# EAGLE design sensorboard_eurobotics2010_r4 (EAGLE 4.16)

## Sheet 1 of 2
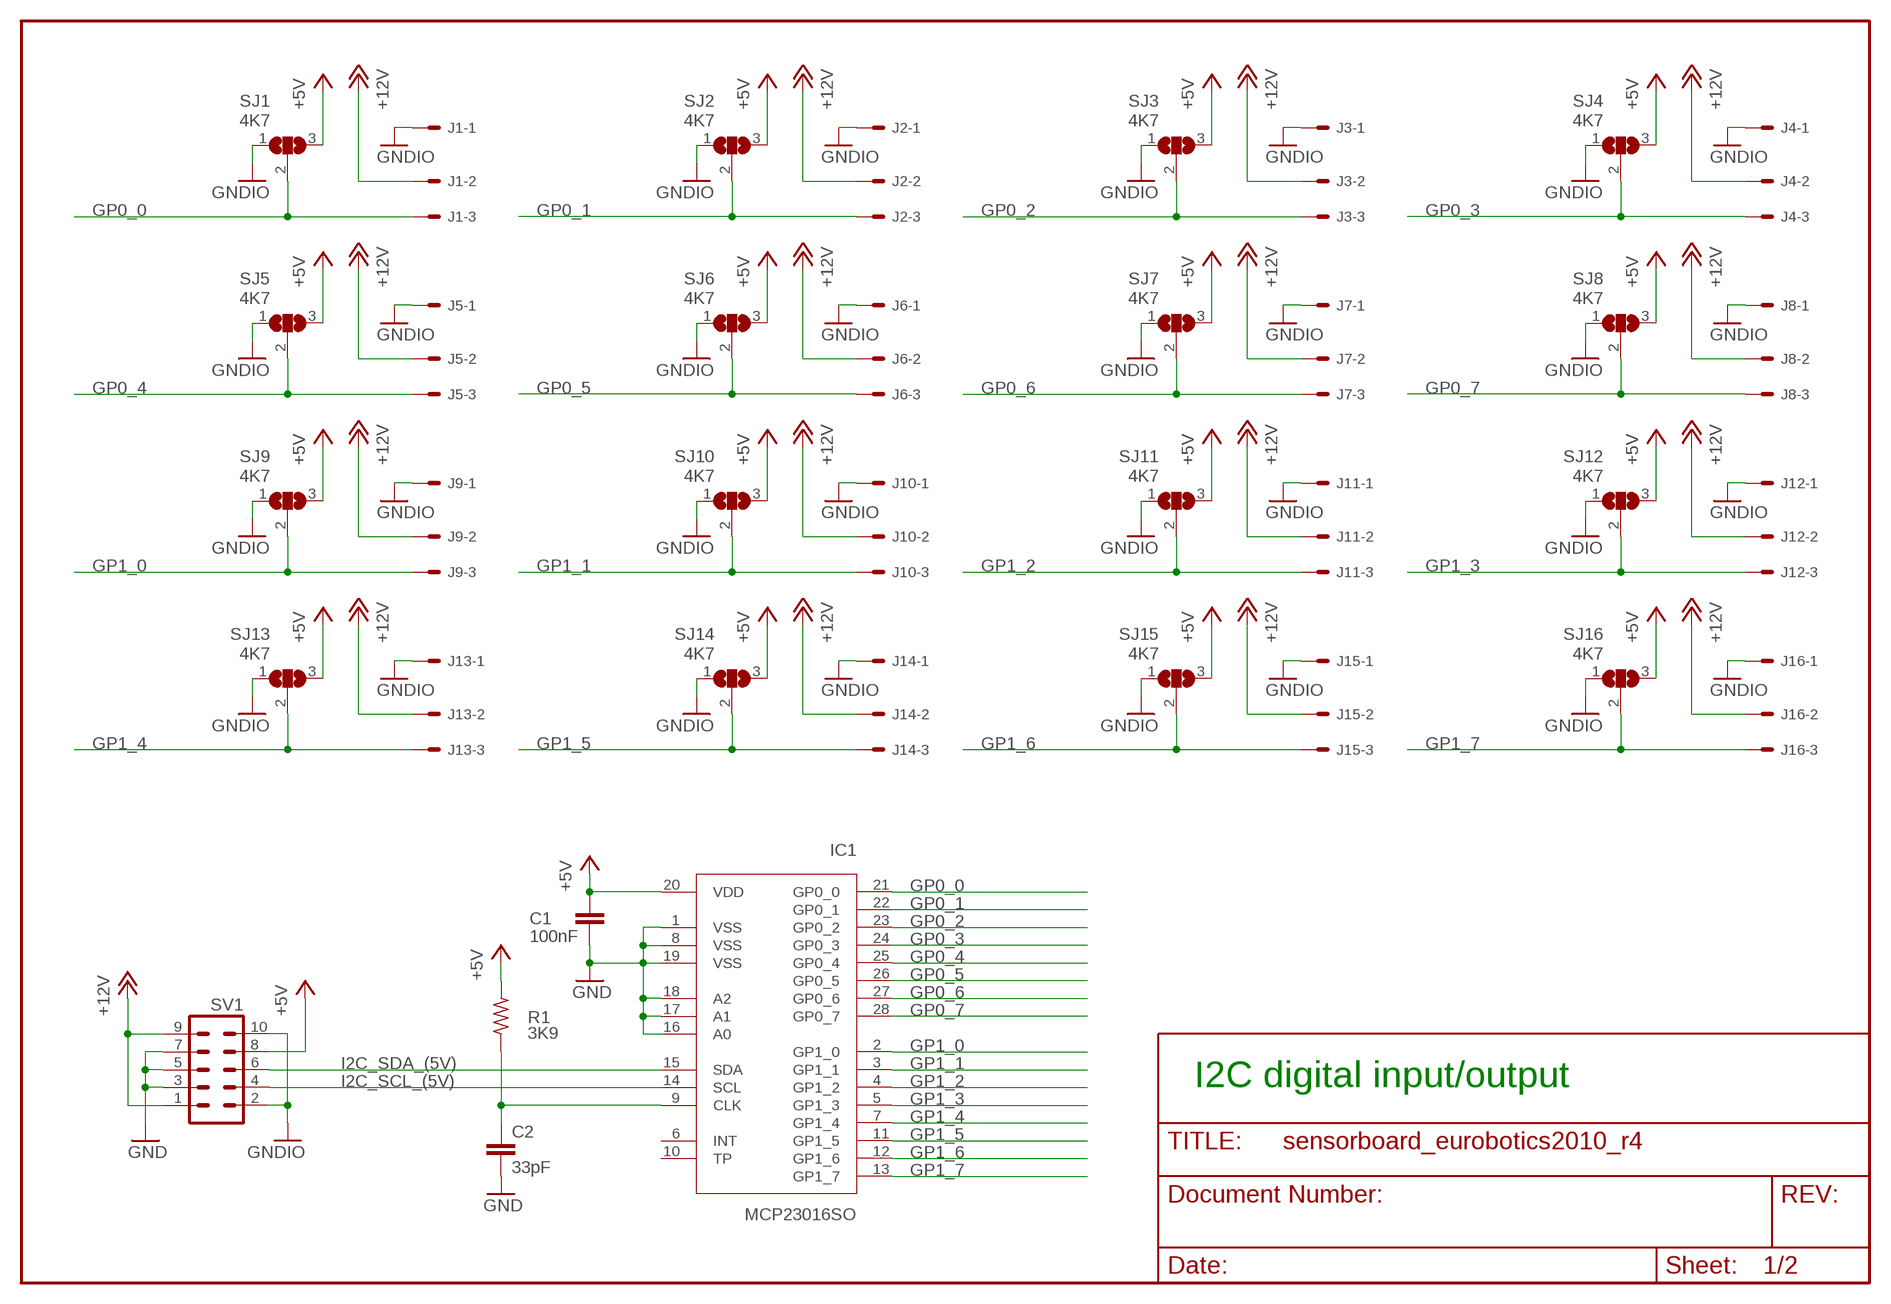
[diagram p0: schematic, sheet 1]

### Parts
C1  100nF  C-EUC0805  [C0805]
C2  33pF  C-EUC0805  [C0805]
IC1  MCP23016SO  MCP32016SO  [SO-28W]
J1  22-27-2031-03  [6410-03]
J2  22-27-2031-03  [6410-03]
J3  22-27-2031-03  [6410-03]
J4  22-27-2031-03  [6410-03]
J5  22-27-2031-03  [6410-03]
J6  22-27-2031-03  [6410-03]
J7  22-27-2031-03  [6410-03]
J8  22-27-2031-03  [6410-03]
J9  22-27-2031-03  [6410-03]
J10  22-27-2031-03  [6410-03]
J11  22-27-2031-03  [6410-03]
J12  22-27-2031-03  [6410-03]
J13  22-27-2031-03  [6410-03]
J14  22-27-2031-03  [6410-03]
J15  22-27-2031-03  [6410-03]
J16  22-27-2031-03  [6410-03]
R1  3K9  R-US_R0805  [R0805]
SJ1  4K7  SJ2W  [SJ_2]
SJ2  4K7  SJ2W  [SJ_2]
SJ3  4K7  SJ2W  [SJ_2]
SJ4  4K7  SJ2W  [SJ_2]
SJ5  4K7  SJ2W  [SJ_2]
SJ6  4K7  SJ2W  [SJ_2]
SJ7  4K7  SJ2W  [SJ_2]
SJ8  4K7  SJ2W  [SJ_2]
SJ9  4K7  SJ2W  [SJ_2]
SJ10  4K7  SJ2W  [SJ_2]
SJ11  4K7  SJ2W  [SJ_2]
SJ12  4K7  SJ2W  [SJ_2]
SJ13  4K7  SJ2W  [SJ_2]
SJ14  4K7  SJ2W  [SJ_2]
SJ15  4K7  SJ2W  [SJ_2]
SJ16  4K7  SJ2W  [SJ_2]
SV1  ML10  [ML10]

### Nets
+5V: C1.1 IC1.20(VDD) R1.2 SJ1.3 SJ2.3 SJ3.3 SJ4.3 SJ5.3 SJ6.3 SJ7.3 SJ8.3 SJ9.3 SJ10.3 SJ11.3 SJ12.3 SJ13.3 SJ14.3 SJ15.3 SJ16.3 SV1.8 ; also sheet 2
+12V: J1.2 J2.2 J3.2 J4.2 J5.2 J6.2 J7.2 J8.2 J9.2 J10.2 J11.2 J12.2 J13.2 J14.2 J15.2 J16.2 SV1.1 SV1.9 ; also sheet 2
GND: C1.2 C2.2 IC1.1(VSS) IC1.8(VSS) IC1.16(A0) IC1.17(A1) IC1.18(A2) IC1.19(VSS) SV1.3 SV1.5 SV1.7 ; also sheet 2
GNDIO: J1.1 J2.1 J3.1 J4.1 J5.1 J6.1 J7.1 J8.1 J9.1 J10.1 J11.1 J12.1 J13.1 J14.1 J15.1 J16.1 SJ1.1 SJ2.1 SJ3.1 SJ4.1 SJ5.1 SJ6.1 SJ7.1 SJ8.1 SJ9.1 SJ10.1 SJ11.1 SJ12.1 SJ13.1 SJ14.1 SJ15.1 SJ16.1 SV1.2 SV1.10 ; also sheet 2
GP0_0: IC1.21(GP0_0) J1.3 SJ1.2
GP0_1: IC1.22(GP0_1) J2.3 SJ2.2
GP0_2: IC1.23(GP0_2) J3.3 SJ3.2
GP0_3: IC1.24(GP0_3) J4.3 SJ4.2
GP0_4: IC1.25(GP0_4) J5.3 SJ5.2
GP0_5: IC1.26(GP0_5) J6.3 SJ6.2
GP0_6: IC1.27(GP0_6) J7.3 SJ7.2
GP0_7: IC1.28(GP0_7) J8.3 SJ8.2
GP1_0: IC1.2(GP1_0) J9.3 SJ9.2
GP1_1: IC1.3(GP1_1) J10.3 SJ10.2
GP1_2: IC1.4(GP1_2) J11.3 SJ11.2
GP1_3: IC1.5(GP1_3) J12.3 SJ12.2
GP1_4: IC1.7(GP1_4) J13.3 SJ13.2
GP1_5: IC1.11(GP1_5) J14.3 SJ14.2
GP1_6: IC1.12(GP1_6) J15.3 SJ15.2
GP1_7: IC1.13(GP1_7) J16.3 SJ16.2
I2C_SCL_(5V): IC1.14(SCL) SV1.4 ; also sheet 2
I2C_SDA_(5V): IC1.15(SDA) SV1.6 ; also sheet 2
N$63: C2.1 IC1.9(CLK) R1.1
Unconnected: IC1.6(INT) IC1.10(TP)

### Notes on the sheet
- I2C digital input/output

## Sheet 2 of 2
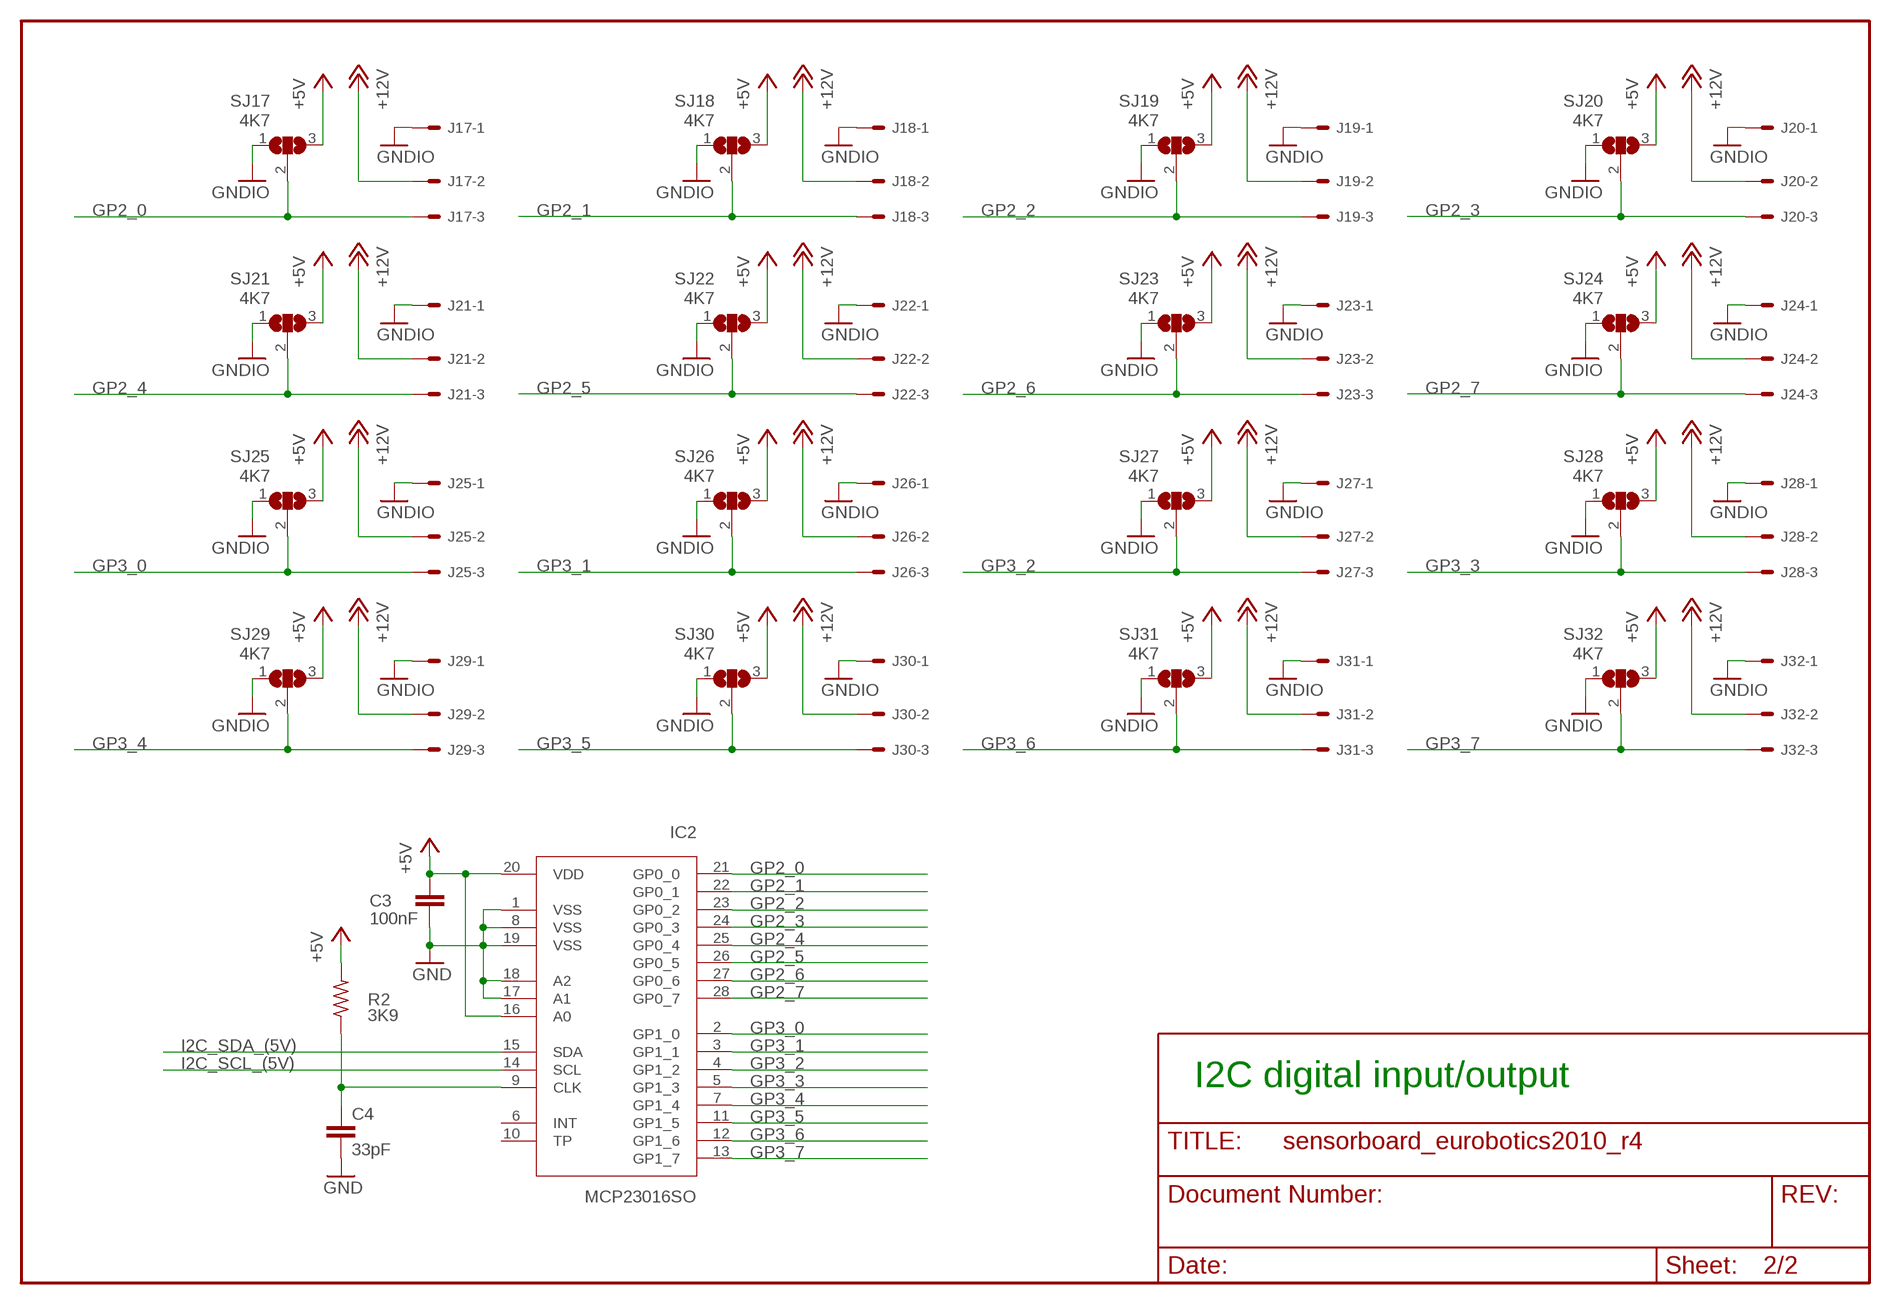
[diagram p1: schematic, sheet 2]

### Parts
C3  100nF  C-EUC0805  [C0805]
C4  33pF  C-EUC0805  [C0805]
IC2  MCP23016SO  MCP32016SO  [SO-28W]
J17  22-27-2031-03  [6410-03]
J18  22-27-2031-03  [6410-03]
J19  22-27-2031-03  [6410-03]
J20  22-27-2031-03  [6410-03]
J21  22-27-2031-03  [6410-03]
J22  22-27-2031-03  [6410-03]
J23  22-27-2031-03  [6410-03]
J24  22-27-2031-03  [6410-03]
J25  22-27-2031-03  [6410-03]
J26  22-27-2031-03  [6410-03]
J27  22-27-2031-03  [6410-03]
J28  22-27-2031-03  [6410-03]
J29  22-27-2031-03  [6410-03]
J30  22-27-2031-03  [6410-03]
J31  22-27-2031-03  [6410-03]
J32  22-27-2031-03  [6410-03]
R2  3K9  R-US_R0805  [R0805]
SJ17  4K7  SJ2W  [SJ_2]
SJ18  4K7  SJ2W  [SJ_2]
SJ19  4K7  SJ2W  [SJ_2]
SJ20  4K7  SJ2W  [SJ_2]
SJ21  4K7  SJ2W  [SJ_2]
SJ22  4K7  SJ2W  [SJ_2]
SJ23  4K7  SJ2W  [SJ_2]
SJ24  4K7  SJ2W  [SJ_2]
SJ25  4K7  SJ2W  [SJ_2]
SJ26  4K7  SJ2W  [SJ_2]
SJ27  4K7  SJ2W  [SJ_2]
SJ28  4K7  SJ2W  [SJ_2]
SJ29  4K7  SJ2W  [SJ_2]
SJ30  4K7  SJ2W  [SJ_2]
SJ31  4K7  SJ2W  [SJ_2]
SJ32  4K7  SJ2W  [SJ_2]

### Nets
+5V: C3.1 IC2.16(A0) IC2.20(VDD) R2.2 SJ17.3 SJ18.3 SJ19.3 SJ20.3 SJ21.3 SJ22.3 SJ23.3 SJ24.3 SJ25.3 SJ26.3 SJ27.3 SJ28.3 SJ29.3 SJ30.3 SJ31.3 SJ32.3 ; also sheet 1
+12V: J17.2 J18.2 J19.2 J20.2 J21.2 J22.2 J23.2 J24.2 J25.2 J26.2 J27.2 J28.2 J29.2 J30.2 J31.2 J32.2 ; also sheet 1
GND: C3.2 C4.2 IC2.1(VSS) IC2.8(VSS) IC2.17(A1) IC2.18(A2) IC2.19(VSS) ; also sheet 1
GNDIO: J17.1 J18.1 J19.1 J20.1 J21.1 J22.1 J23.1 J24.1 J25.1 J26.1 J27.1 J28.1 J29.1 J30.1 J31.1 J32.1 SJ17.1 SJ18.1 SJ19.1 SJ20.1 SJ21.1 SJ22.1 SJ23.1 SJ24.1 SJ25.1 SJ26.1 SJ27.1 SJ28.1 SJ29.1 SJ30.1 SJ31.1 SJ32.1 ; also sheet 1
GP2_0: IC2.21(GP0_0) J17.3 SJ17.2
GP2_1: IC2.22(GP0_1) J18.3 SJ18.2
GP2_2: IC2.23(GP0_2) J19.3 SJ19.2
GP2_3: IC2.24(GP0_3) J20.3 SJ20.2
GP2_4: IC2.25(GP0_4) J21.3 SJ21.2
GP2_5: IC2.26(GP0_5) J22.3 SJ22.2
GP2_6: IC2.27(GP0_6) J23.3 SJ23.2
GP2_7: IC2.28(GP0_7) J24.3 SJ24.2
GP3_0: IC2.2(GP1_0) J25.3 SJ25.2
GP3_1: IC2.3(GP1_1) J26.3 SJ26.2
GP3_2: IC2.4(GP1_2) J27.3 SJ27.2
GP3_3: IC2.5(GP1_3) J28.3 SJ28.2
GP3_4: IC2.7(GP1_4) J29.3 SJ29.2
GP3_5: IC2.11(GP1_5) J30.3 SJ30.2
GP3_6: IC2.12(GP1_6) J31.3 SJ31.2
GP3_7: IC2.13(GP1_7) J32.3 SJ32.2
I2C_SCL_(5V): IC2.14(SCL) ; also sheet 1
I2C_SDA_(5V): IC2.15(SDA) ; also sheet 1
N$2: C4.1 IC2.9(CLK) R2.1
Unconnected: IC2.6(INT) IC2.10(TP)

### Notes on the sheet
- I2C digital input/output

## Library data of the parts
C1-C4 = rcl:C-EU: CAPACITOR, European symbol
IC1 IC2 = eagle_jbs_lib:MCP32016: 16-Bit I2C I/O Expander
J1-J32 = con-molex:22-?-03: CONNECTOR wire to board 2.54 mm (.1 inch) pitch header
R1 R2 = rcl:R-US_: RESISTOR, American symbol
SJ1-SJ32 = jumper:SJ2W: SMD solder JUMPER
SV1 = con-harting-ml:ML10: HARTING

## Board
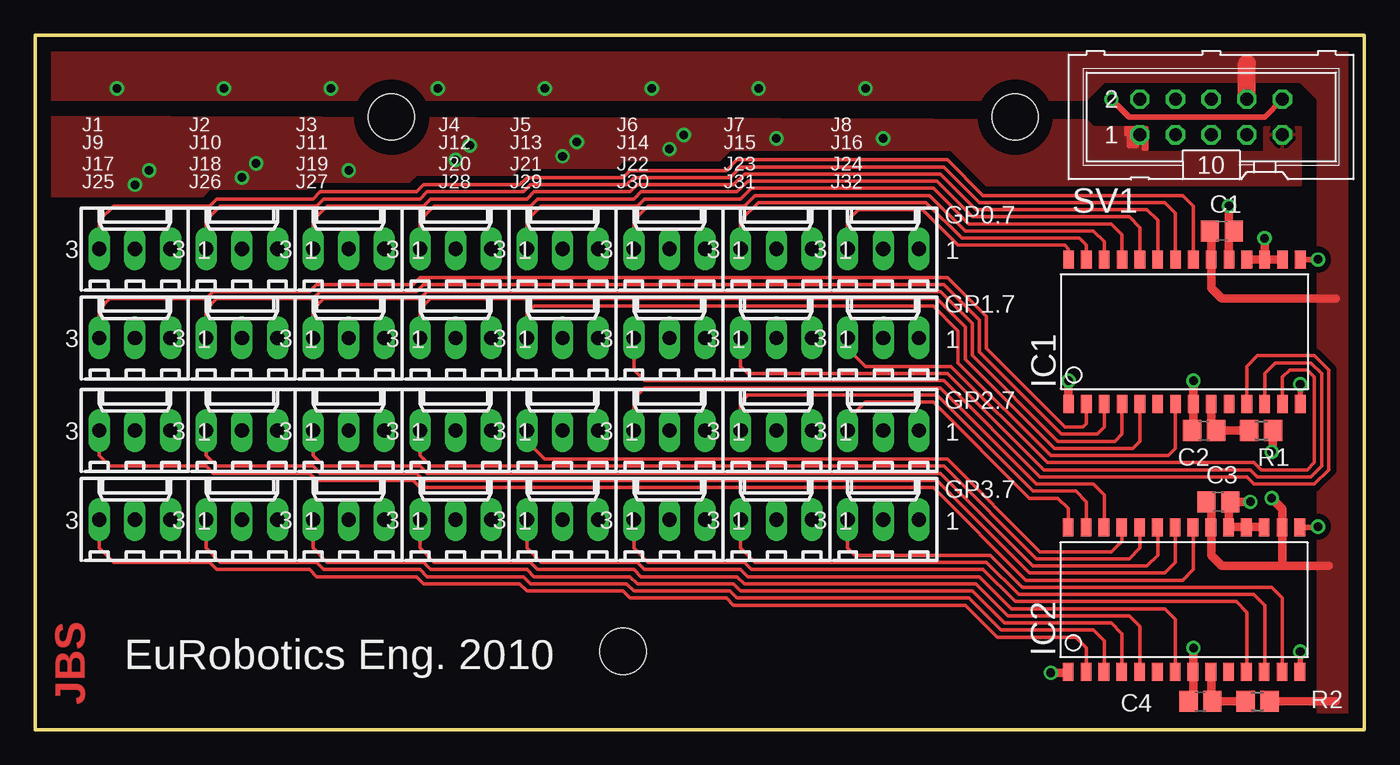
[diagram p2: board, top side]
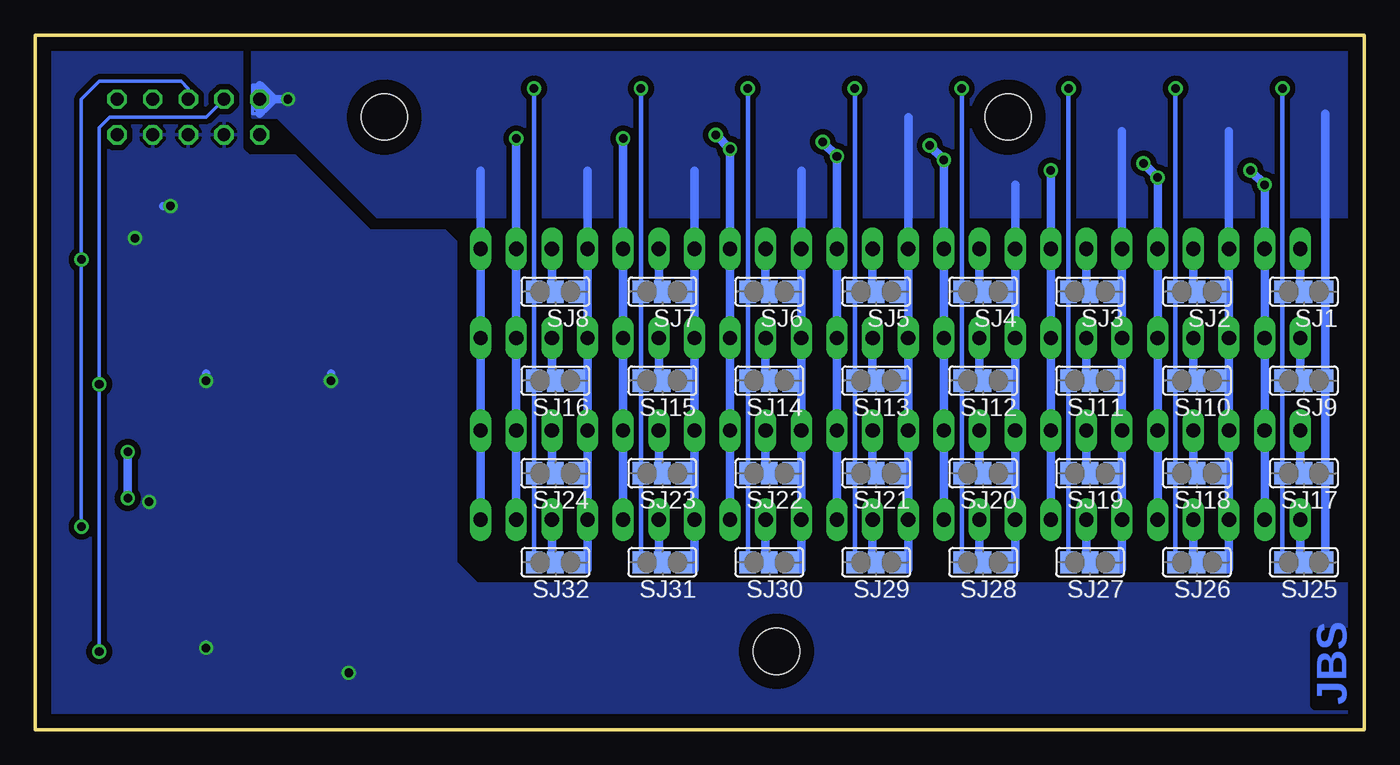
[diagram p3: board, bottom side, seen from below]

Size 94.74 x 49.53 mm. Coordinates in mm from the lower left corner, seen from the top.
Outline: 0,0 0,49.53 94.74,49.53 94.74,0 0,0
Copper layers (1*16): Top 0.035mm / dielectric 1.5mm / Bottom 0.035mm
Design rules "olimex": minimum track width 10mil, minimum drill 24mil, track to track 8mil, track to pad 8mil, pad to pad 8mil, via to via 8mil, smd to smd 8mil, copper to edge 40mil, drill to drill 8mil, minimum pad ring 8mil, minimum via ring 8mil, stop-mask expansion 4mil, vias tented up to drill 0mil, thermal gap 10mil
Holes 3.3 mm at 69.85,43.69 25.4,43.69 41.91,5.59

### Footprints (pad centres in the part's own frame; a part is rotated, then mirrored left to right if it is on the bottom)
C0805 = smd 1.3 x 1.5: 1 -0.85,0; 2 0.85,0
SO-28W = smd 0.762 x 1.27: 1 -7.62,-5.207; 2 -6.35,-5.207; 3 -5.08,-5.207; 4 -3.81,-5.207; 5 -2.54,-5.207; 6 -1.27,-5.207; 7 0,-5.207; 8 1.27,-5.207; 9 2.54,-5.207; 10 3.81,-5.207; 11 5.08,-5.207; 12 6.35,-5.207; 13 7.62,-5.207; 14 8.89,-5.207; 15 8.89,5.08; 16 7.62,5.08; 17 6.35,5.08; 18 5.08,5.08; 19 3.81,5.08; 20 2.54,5.08; 21 1.27,5.08; 22 0,5.08; 23 -1.27,5.08; 24 -2.54,5.08; 25 -3.81,5.08; 26 -5.08,5.08; 27 -6.35,5.08; 28 -7.62,5.08
6410-03 = drill 1.016 long: 1 2.54,0; 2 0,0; 3 -2.54,0
R0805 = smd 1.3 x 1.5: 1 -0.85,0; 2 0.85,0
SJ_2 = smd 1.168 x 1.6: 1 -1.524,0; 2 0,0; 3 1.524,0
ML10 = drill 0.914 octagon: 1 -5.08,-1.27; 2 -5.08,1.27; 3 -2.54,-1.27; 4 -2.54,1.27; 5 0,-1.27; 6 0,1.27; 7 2.54,-1.27; 8 2.54,1.27; 9 5.08,-1.27; 10 5.08,1.27

### Placement (x,y rotation side)
C1  84.58,35.56 0 top
C2  83.31,21.34 180 top
C3  84.33,16.26 0 top
C4  83.06,2.03 180 top
IC1  81.28,28.45 0 top
IC2  81.25,9.34 0 top
J1  7.11,34.29 0 top
J2  14.73,34.29 0 top
J3  22.35,34.29 0 top
J4  29.97,34.29 0 top
J5  37.59,34.29 0 top
J6  45.21,34.29 0 top
J7  52.83,34.29 0 top
J8  60.45,34.29 0 top
J9  7.11,27.94 0 top
J10  14.73,27.94 0 top
J11  22.35,27.94 0 top
J12  29.97,27.94 0 top
J13  37.59,27.94 0 top
J14  45.21,27.94 0 top
J15  52.83,27.94 0 top
J16  60.45,27.94 0 top
J17  7.11,21.34 0 top
J18  14.73,21.34 0 top
J19  22.35,21.34 0 top
J20  29.97,21.34 0 top
J21  37.59,21.34 0 top
J22  45.21,21.34 0 top
J23  52.83,21.34 0 top
J24  60.45,21.34 0 top
J25  7.11,14.99 0 top
J26  14.73,14.99 0 top
J27  22.35,14.99 0 top
J28  29.97,14.99 0 top
J29  37.59,14.99 0 top
J30  45.21,14.99 0 top
J31  52.83,14.99 0 top
J32  60.45,14.99 0 top
R1  87.38,21.34 0 top
R2  87.12,2.03 0 top
SJ1  4.32,31.24 180 bottom
SJ2  11.94,31.24 180 bottom
SJ3  19.56,31.24 180 bottom
SJ4  27.18,31.24 180 bottom
SJ5  34.8,31.24 180 bottom
SJ6  42.42,31.24 180 bottom
SJ7  50.04,31.24 180 bottom
SJ8  57.66,31.24 180 bottom
SJ9  4.32,24.89 180 bottom
SJ10  11.94,24.89 180 bottom
SJ11  19.56,24.89 180 bottom
SJ12  27.18,24.89 180 bottom
SJ13  34.8,24.89 180 bottom
SJ14  42.42,24.89 180 bottom
SJ15  50.04,24.89 180 bottom
SJ16  57.66,24.89 180 bottom
SJ17  4.32,18.29 180 bottom
SJ18  11.94,18.29 180 bottom
SJ19  19.56,18.29 180 bottom
SJ20  27.18,18.29 180 bottom
SJ21  34.8,18.29 180 bottom
SJ22  42.42,18.29 180 bottom
SJ23  50.04,18.29 180 bottom
SJ24  57.66,18.29 180 bottom
SJ25  4.32,11.94 180 bottom
SJ26  11.94,11.94 180 bottom
SJ27  19.56,11.94 180 bottom
SJ28  27.18,11.94 180 bottom
SJ29  34.8,11.94 180 bottom
SJ30  42.42,11.94 180 bottom
SJ31  50.04,11.94 180 bottom
SJ32  57.66,11.94 180 bottom
SV1  83.82,43.69 0 top

### Tracks (layer width: path | path; a pad name or v marks a point on that pad's centre or on a via)
+5V  (via drill 0.61)
  Top 0.61: C1.1 83.82,35.56 IC1.20 83.82,31.5 84.58,30.73 92.71,30.73 | C3.1 83.82,16.26 83.82,14.48 | 88.9,11.68 88.9,14.39 IC2.16 88.87,14.45 88.9,14.48 88.9,15.75 v88.14,16.51 | 83.82,14.48 83.82,14.46 IC2.20 | 83.82,14.48 83.82,12.45 84.58,11.68 88.9,11.68 | 88.9,11.68 92.2,11.68 | 92.71,2.03 R2.2 | R1.2 88.23,19.9 v88.14,19.81
  Top 1.27: SV1.8 86.36,47.5
  Bottom 0.305: SJ25.3 SJ17.3 SJ9.3 SJ1.3 | SJ2.3 SJ10.3 SJ18.3 SJ26.3 v13.46,45.72 | SJ3.3 SJ11.3 SJ19.3 SJ27.3 SJ3.3 | SJ4.3 SJ12.3 SJ20.3 SJ28.3 SJ4.3 | SJ5.3 SJ13.3 SJ21.3 SJ29.3 v36.32,45.72 | SJ30.3 SJ22.3 SJ14.3 SJ6.3 v43.94,45.72 | SJ31.3 SJ23.3 SJ15.3 SJ7.3 | SJ32.3 SJ24.3 SJ16.3 SJ8.3 | SJ8.3 59.18,43.94 | SJ1.3 5.84,43.94 | SJ31.3 51.56,43.94 | SJ4.3 28.7,43.94 | SJ3.3 21.08,43.94 | v5.84,45.72 SJ1.3 | v21.08,45.72 SJ3.3 | v28.7,45.72 SJ4.3 | v51.56,45.72 SJ31.3 | v59.18,45.72 SJ8.3
  Bottom 0.61: v88.14,19.81 v88.14,16.51
  pour Top (isolate 0.406): 91.44,-0.76 95.25,-0.76 95,50.04 -1.27,50.04 -1.27,44.96 74.93,44.96 76.2,46.23 90.17,46.23 91.44,44.96
+12V  (via drill 0.61)
  Top 0.254: SV1.1 77.72,42.42 77.72,42.93 79.25,42.93 79.25,41.4 78.99,41.4 78.99,42.67
  Top 0.406: 78.99,42.67 77.98,42.67 77.98,41.66 78.49,41.66 78.49,42.16 78.23,42.16 78.23,41.91
  Bottom 0.61: 7.11,34.04 J9.2 J17.2 J25.2 | J26.2 J18.2 J10.2 J2.2 v14.73,39.37 v15.75,40.39 | J27.2 J19.2 J11.2 22.35,34.04 | J28.2 J20.2 J12.2 J4.2 v29.97,40.64 v30.99,41.66 | J21.2 37.59,21.59 | J21.2 J29.2 v37.59,40.89 v38.61,41.91 | J21.2 J13.2 J5.2 37.59,34.54 | J30.2 J22.2 J14.2 | J14.2 45.21,28.19 | J14.2 J6.2 v45.21,41.4 v46.23,42.42 | J31.2 J23.2 J15.2 J7.2 v52.83,42.16 | J32.2 J24.2 J16.2 J8.2 v60.45,42.16 | 7.11,34.04 J1.2 | 22.35,34.04 J3.2 | v8.13,39.88 v7.11,38.86 7.11,34.04 | v22.35,39.88 22.35,34.04
  pour Top (isolate 0.406): 90.17,42.93 90.17,38.86 67.82,38.86 65.28,41.4 49.53,41.4 48.77,40.64 41.91,40.64 41.4,40.13 34.54,40.13 34.04,39.62 27.18,39.62 26.67,39.12 19.81,39.12 19.3,38.61 12.45,38.61 11.94,38.1 -1.27,38.1 -1.27,43.69 74.93,43.43 75.44,42.93 79.25,42.93 79.25,41.15 87.63,41.15 87.63,42.93
GND  (via drill 0.61)
  Top 0.61: IC1.17 IC1.16 IC1.17 | IC1.17 IC1.18 IC1.17 | 85.09,35.56 IC1.19 | 85.09,35.56 C1.2 | v85.09,37.34 85.09,35.56 | IC1.17 v87.63,35.05 | IC2.19 85.09,14.46 85.09,14.48 | 85.09,14.48 85.09,16.26 C3.2 v86.61,16.26 | 87.63,14.48 87.63,14.46 IC2.17 | IC2.18 86.38,14.48 87.63,14.48 | v73.66,24.89 IC1.1 | C2.2 82.55,21.34 IC1.8 v82.55,24.89 | C4.2 82.55,2.03 82.55,4.11 IC2.8 82.55,4.17 v82.55,5.84 | IC2.1 73.55,4.06 v72.39,4.06 | 85.09,14.48 87.63,14.48
  Bottom 0.61: v85.09,37.34 85.6,37.34 | v86.61,16.26 86.61,16.51 | v73.66,24.89 73.66,25.4 | v82.55,24.89 82.55,25.4 | v82.55,5.84 82.55,6.1 | v72.39,4.06 72.14,4.06
  pour Bottom (isolate 0.406): 70.87,35.56 65.53,35.56 64.77,34.8 64.77,11.94 63.25,10.41 -1.27,10.41 -1.27,-0.76 95.25,-0.76 95.25,51.31 80.01,51.31 80.01,41.4 79.5,40.89 76.2,40.89
GNDIO  (via drill 0.61)
  Top 0.406: SV1.10 87.63,43.69 77.98,43.69 v76.71,44.96
  Bottom 0.254: 78.49,44.2 78.49,43.94 79.25,43.94 79.25,45.97 78.99,45.97 78.99,44.2
  Bottom 0.406: v76.71,44.96 76.71,45.21
  Bottom 0.61: J24.1 62.99,21.59 | J24.1 J32.1 | J16.1 62.99,28.19 | J16.1 J24.1 | J16.1 J8.1 62.99,39.88 | 55.37,11.43 56.13,11.43 SJ32.1 | 55.37,11.43 J31.1 55.37,18.29 | 55.37,18.29 J23.1 55.37,24.89 | 55.37,24.89 J15.1 55.37,31.24 | 55.37,31.24 J7.1 | 55.37,31.24 SJ8.1 | 55.37,24.89 SJ16.1 | 55.37,18.29 SJ24.1 | SJ31.1 48.51,11.43 47.75,11.43 | 47.75,11.43 J30.1 47.75,18.29 | 47.75,18.29 J22.1 47.75,24.89 | 47.75,24.89 J14.1 47.75,31.24 | 47.75,31.24 J6.1 | 47.75,31.24 SJ7.1 | 47.75,24.89 SJ15.1 | 47.75,18.29 SJ23.1 | SJ30.1 40.89,11.43 40.13,11.43 J29.1 40.13,18.29 | 40.13,18.29 J21.1 40.13,24.89 | 40.13,24.89 J13.1 40.13,31.24 | 40.13,31.24 J5.1 | 40.13,24.89 SJ14.1 | 40.13,18.29 SJ22.1 | SJ29.1 33.27,11.43 32.51,11.43 J28.1 32.51,18.29 | 32.51,18.29 J20.1 32.51,24.89 | 32.51,24.89 J12.1 32.51,31.24 | 32.51,31.24 J4.1 32.51,43.69 | 32.51,31.24 SJ5.1 | 32.51,24.89 SJ13.1 | 32.51,18.29 SJ21.1 | SJ28.1 25.65,11.43 24.89,11.43 J27.1 24.89,18.29 | 24.89,18.29 J19.1 24.89,24.89 | 24.89,24.89 J11.1 24.89,31.24 | 24.89,31.24 J3.1 24.89,38.86 | 24.89,31.24 SJ4.1 | 24.89,24.89 SJ12.1 | 24.89,18.29 SJ20.1 | SJ27.1 18.03,11.43 17.27,11.43 J26.1 17.27,18.29 | 17.27,18.29 J18.1 17.27,24.89 | 17.27,24.89 J10.1 17.27,31.24 | 17.27,31.24 J2.1 17.27,42.67 | 17.27,31.24 SJ3.1 | 17.27,24.89 SJ11.1 | 17.27,18.29 SJ19.1 | SJ26.1 10.41,11.43 9.65,11.43 J25.1 9.65,18.29 | 9.65,18.29 J17.1 9.65,24.89 | 9.65,24.89 J9.1 9.65,31.24 | 9.65,31.24 J1.1 9.65,42.67 | 9.65,31.24 SJ2.1 | 9.65,24.89 SJ10.1 | 9.65,18.29 SJ18.1 | SJ25.1 SJ17.1 SJ9.1 SJ1.1 2.79,43.94 | 55.37,39.88 55.37,11.43 | 47.75,39.88 47.75,11.43 | 40.13,31.24 SJ6.1 | 40.13,39.88 40.13,31.24 | 77.72,44.96 v76.71,44.96 | 77.72,44.96 78.74,45.97 78.74,43.94 78.49,44.2
  Bottom 0.61: 78.49,44.2 77.72,44.96 | 77.72,44.96 78.49,44.96 | 78.49,44.96 78.49,45.47 | 78.49,44.2 78.49,44.96
  pour Bottom (isolate 0.406): 79.25,50.55 79.25,43.69 77.47,43.69 70.36,36.58 -1.52,36.58 -1.52,50.55
GP0_0
  Top 0.254: J1.3 4.57,36.32 5.59,37.34 12.45,37.34 12.95,37.85 19.81,37.85 20.32,38.35 27.18,38.35 27.69,38.86 34.54,38.86 35.05,39.37 41.91,39.37 42.42,39.88 49.28,39.88 50.04,40.64 65.02,40.64 67.56,38.1 81.79,38.1 82.55,37.34 IC1.21
  Bottom 0.61: SJ1.2 4.57,31.24 J1.3
GP0_1
  Top 0.254: J2.3 12.19,36.32 13.21,37.34 20.07,37.34 20.57,37.85 27.43,37.85 27.94,38.35 34.8,38.35 35.31,38.86 42.16,38.86 42.67,39.37 49.53,39.37 50.29,40.13 64.77,40.13 67.31,37.59 80.52,37.59 81.28,36.83 IC1.22
  Bottom 0.61: SJ2.2 12.19,31.24 J2.3
GP0_2
  Top 0.254: J3.3 19.81,36.32 20.83,37.34 27.69,37.34 28.19,37.85 35.05,37.85 35.56,38.35 42.42,38.35 42.93,38.86 49.78,38.86 50.55,39.62 64.52,39.62 67.06,37.08 79.25,37.08 80.01,36.32 IC1.23
  Bottom 0.61: SJ3.2 19.81,31.24 J3.3 19.81,34.54
GP0_3
  Top 0.254: J4.3 27.43,36.32 28.45,37.34 35.31,37.34 35.81,37.85 42.67,37.85 43.18,38.35 50.04,38.35 50.8,39.12 64.26,39.12 66.8,36.58 77.98,36.58 78.74,35.81 IC1.24
  Bottom 0.61: SJ4.2 27.43,31.24 J4.3
GP0_4
  Top 0.254: J5.3 35.05,36.32 36.07,37.34 42.93,37.34 43.43,37.85 50.29,37.85 51.05,38.61 64.01,38.61 66.55,36.07 76.71,36.07 77.47,35.31 IC1.25
  Bottom 0.61: SJ5.2 35.05,31.24 J5.3
GP0_5
  Top 0.254: J6.3 42.67,36.32 43.69,37.34 50.55,37.34 51.31,38.1 63.75,38.1 66.29,35.56 75.44,35.56 76.2,34.8 IC1.26
  Bottom 0.61: SJ6.2 42.67,31.24 J6.3
GP0_6
  Top 0.254: J7.3 50.29,36.32 51.56,37.59 63.5,37.59 66.04,35.05 74.42,35.05 74.93,34.54 IC1.27
  Bottom 0.61: SJ7.2 50.29,31.24 J7.3
GP0_7
  Top 0.254: J8.3 57.91,36.32 58.67,37.08 63.25,37.08 65.79,34.54 73.41,34.54 73.66,34.29 IC1.28
  Bottom 0.61: SJ8.2 57.91,31.24 J8.3
GP1_0
  Top 0.254: J9.3 4.57,29.97 5.33,30.73 12.19,30.73 12.7,31.24 19.56,31.24 20.07,31.75 26.92,31.75 27.43,32.26 65.02,32.26 67.82,29.46 67.82,27.18 73.41,21.59 74.68,21.59 74.93,21.84 IC1.2
  Bottom 0.61: SJ9.2 4.57,24.89 J9.3
GP1_1
  Top 0.254: J10.3 12.19,29.97 12.95,30.73 19.81,30.73 20.32,31.24 27.18,31.24 27.69,31.75 64.77,31.75 67.31,29.21 67.31,26.92 73.15,21.08 75.69,21.08 76.2,21.59 IC1.3
  Bottom 0.61: SJ10.2 12.19,24.89 J10.3
GP1_2
  Top 0.254: J11.3 19.81,29.97 20.57,30.73 27.43,30.73 27.94,31.24 64.52,31.24 66.8,28.96 66.8,26.67 72.9,20.57 76.96,20.57 77.47,21.08 IC1.4 77.47,23.37
  Bottom 0.61: SJ11.2 19.81,24.89 J11.3
GP1_3
  Top 0.254: J12.3 27.43,29.97 28.19,30.73 64.26,30.73 66.29,28.7 66.29,26.42 72.64,20.07 78.23,20.07 78.74,20.57 IC1.5
  Bottom 0.61: SJ12.2 27.43,24.89 J12.3
GP1_4
  Top 0.254: J13.3 35.05,29.72 35.56,30.23 64.01,30.23 65.79,28.45 65.79,26.16 72.39,19.56 80.77,19.56 81.28,20.07 IC1.7 81.28,23.37
  Bottom 0.61: SJ13.2 35.05,24.89 J13.3
GP1_5
  Top 0.254: J14.3 42.67,25.65 43.43,24.89 64.77,24.89 71.63,18.03 86.36,18.03 86.87,17.53 91.19,17.53 92.2,18.54 92.2,25.65 91.19,26.67 87.12,26.67 86.36,25.91 IC1.11
  Bottom 0.61: SJ14.2 42.67,24.89 J14.3
GP1_6
  Top 0.254: J15.3 50.29,25.91 50.8,25.4 65.02,25.4 71.88,18.54 86.61,18.54 87.12,18.03 90.93,18.03 91.69,18.8 91.69,25.4 90.93,26.16 88.39,26.16 87.63,25.4 IC1.12 87.63,23.11
  Bottom 0.61: SJ15.2 50.29,24.89 J15.3
GP1_7
  Top 0.254: J16.3 57.91,27.18 59.18,25.91 65.28,25.91 72.14,19.05 86.87,19.05 87.38,18.54 90.68,18.54 91.19,19.05 91.19,25.15 90.68,25.65 89.41,25.65 88.9,25.15 IC1.13
  Bottom 0.61: SJ16.2 57.91,24.89 J16.3
GP2_0
  Top 0.254: J17.3 4.57,19.56 5.33,18.8 12.19,18.8 12.7,18.29 19.56,18.29 20.07,17.78 26.92,17.78 27.43,17.27 64.01,17.27 70.61,10.67 81.79,10.67 82.55,11.43 82.55,14.22 82.35,14.42 | 82.35,14.42 82.3,14.48 | IC2.21 82.35,14.42
  Bottom 0.61: SJ17.2 4.57,18.29 J17.3
GP2_1
  Top 0.254: J18.3 12.19,19.56 12.95,18.8 19.81,18.8 20.32,18.29 27.18,18.29 27.69,17.78 64.26,17.78 70.87,11.18 80.52,11.18 81.28,11.94 81.28,14.48 81.25,14.45 IC2.22
  Bottom 0.61: SJ18.2 12.19,18.29 J18.3
GP2_2
  Top 0.254: J19.3 19.81,19.56 20.57,18.8 27.43,18.8 27.94,18.29 64.52,18.29 71.12,11.68 79.25,11.68 80.01,12.45 80.01,14.48 79.98,14.45 IC2.23
  Bottom 0.61: SJ19.2 19.81,18.29 J19.3
GP2_3
  Top 0.254: J20.3 27.43,19.56 28.19,18.8 64.77,18.8 71.37,12.19 77.98,12.19 78.74,12.95 78.74,14.22 78.71,14.26 IC2.24
  Bottom 0.61: SJ20.2 27.43,18.29 J20.3
GP2_4
  Top 0.254: J21.3 35.05,20.57 36.32,19.3 65.02,19.3 71.63,12.7 76.71,12.7 77.44,13.43 IC2.25
  Bottom 0.61: SJ21.2 35.05,18.29 J21.3
GP2_5
  Top 0.254: J22.3 42.67,23.62 43.43,24.38 64.52,24.38 71.37,17.53 75.44,17.53 76.2,16.76 76.2,14.48 76.17,14.45 IC2.26
  Bottom 0.61: SJ22.2 42.67,18.29 J22.3
GP2_6
  Top 0.254: J23.3 50.29,23.37 50.8,23.88 64.26,23.88 71.12,17.02 74.17,17.02 74.93,16.26 74.93,14.48 74.9,14.45 IC2.27
  Bottom 0.61: SJ23.2 50.29,18.29 J23.3
GP2_7
  Top 0.254: J24.3 57.91,22.1 59.18,23.37 64.01,23.37 70.87,16.51 72.9,16.51 73.63,15.78 IC2.28
  Bottom 0.61: SJ24.2 57.91,18.29 J24.3
GP3_0
  Top 0.254: J25.3 4.57,12.95 5.59,11.94 12.45,11.94 12.95,11.43 19.56,11.43 20.07,10.92 27.18,10.92 27.69,10.41 34.54,10.41 35.05,9.91 41.91,9.91 42.42,9.4 49.28,9.4 49.78,8.89 66.29,8.89 68.58,6.6 74.17,6.6 74.93,5.84 74.93,4.32 74.9,4.29 IC2.2
  Bottom 0.61: SJ25.2 4.57,11.94 J25.3
GP3_1
  Top 0.254: J26.3 12.19,12.95 13.21,11.94 20.07,11.94 20.57,11.43 27.43,11.43 27.94,10.92 34.8,10.92 35.31,10.41 42.16,10.41 42.67,9.91 49.53,9.91 50.04,9.4 66.55,9.4 68.83,7.11 75.44,7.11 76.2,6.35 76.2,4.32 76.17,4.29 IC2.3
  Bottom 0.61: SJ26.2 12.19,11.94 J26.3
GP3_2
  Top 0.254: J27.3 19.81,12.95 20.83,11.94 27.69,11.94 28.19,11.43 35.05,11.43 35.56,10.92 42.42,10.92 42.93,10.41 49.78,10.41 50.29,9.91 66.8,9.91 69.09,7.62 76.71,7.62 77.47,6.86 77.47,4.32 77.44,4.29 IC2.4
  Bottom 0.61: SJ27.2 19.81,11.94 J27.3
GP3_3
  Top 0.254: J28.3 27.43,12.95 28.45,11.94 35.31,11.94 35.81,11.43 42.67,11.43 43.18,10.92 50.04,10.92 50.55,10.41 67.06,10.41 69.34,8.13 77.98,8.13 78.74,7.37 78.74,4.06 78.71,4.1 IC2.5
  Bottom 0.61: SJ28.2 27.43,11.94 J28.3
GP3_4
  Top 0.254: J29.3 35.05,12.95 36.07,11.94 42.93,11.94 43.43,11.43 50.29,11.43 50.8,10.92 67.31,10.92 69.6,8.64 80.52,8.64 81.28,7.87 81.28,4.32 81.25,4.29 IC2.7
  Bottom 0.61: SJ29.2 35.05,11.94 J29.3
GP3_5
  Top 0.254: J30.3 42.67,12.95 43.69,11.94 50.55,11.94 51.05,11.43 67.56,11.43 69.85,9.14 85.6,9.14 86.36,8.38 86.36,4.32 86.33,4.29 IC2.11
  Bottom 0.61: SJ30.2 42.67,11.94 J30.3
GP3_6
  Top 0.254: J31.3 50.29,12.95 51.31,11.94 67.82,11.94 70.1,9.65 86.87,9.65 87.63,8.89 87.63,4.32 87.6,4.29 IC2.12
  Bottom 0.61: SJ31.2 50.29,11.94 J31.3
GP3_7
  Top 0.254: J32.3 57.91,12.95 58.42,12.45 68.07,12.45 70.36,10.16 88.14,10.16 88.9,9.4 88.9,4.32 88.87,4.29 IC2.13
  Bottom 0.61: SJ32.2 57.91,11.94 J32.3
I2C_SCL_(5V)  (via drill 0.61)
  Top 0.305: IC2.14 90.17,4.17
  Top 0.406: IC1.14 90.17,23.37 | IC1.14 v90.17,24.64 IC1.14 | v90.17,5.59 90.17,4.32 | 90.17,4.32 90.14,4.29 IC2.14 | 90.17,4.32 90.17,4.06
  Bottom 0.254: v90.17,5.59 v90.17,24.64 90.17,42.93 89.41,43.69 82.55,43.69 SV1.4
I2C_SDA_(5V)  (via drill 0.61)
  Top 0.406: 91.41,14.45 v91.44,14.48 91.39,14.42 IC2.15 | v91.44,33.53 IC1.15
  Bottom 0.254: v91.44,14.48 v91.44,33.53 91.44,44.96 90.17,46.23 84.33,46.23 83.82,45.72 SV1.6
N$2
  Top 0.61: IC2.9 83.82,4.11 83.82,2.03 C4.1 R2.1 85.6,2.03
N$63
  Top 0.61: IC1.9 83.82,21.34 C2.1 R1.1 85.85,21.34

### Text on the board
Top: JBS
Bottom: JBS
tNames: GP0.7 | GP1.7 | GP2.7 | GP3.7 | EuRobotics Eng. 2010
Drill_legend: Drill legend | Date: 15/02/2010 12:30:14 | 3.3020 mm / 130.000 mil | 1.0160 mm / 40.000 mil | 0.9144 mm / 36.000 mil | 0.6096 mm / 24.000 mil